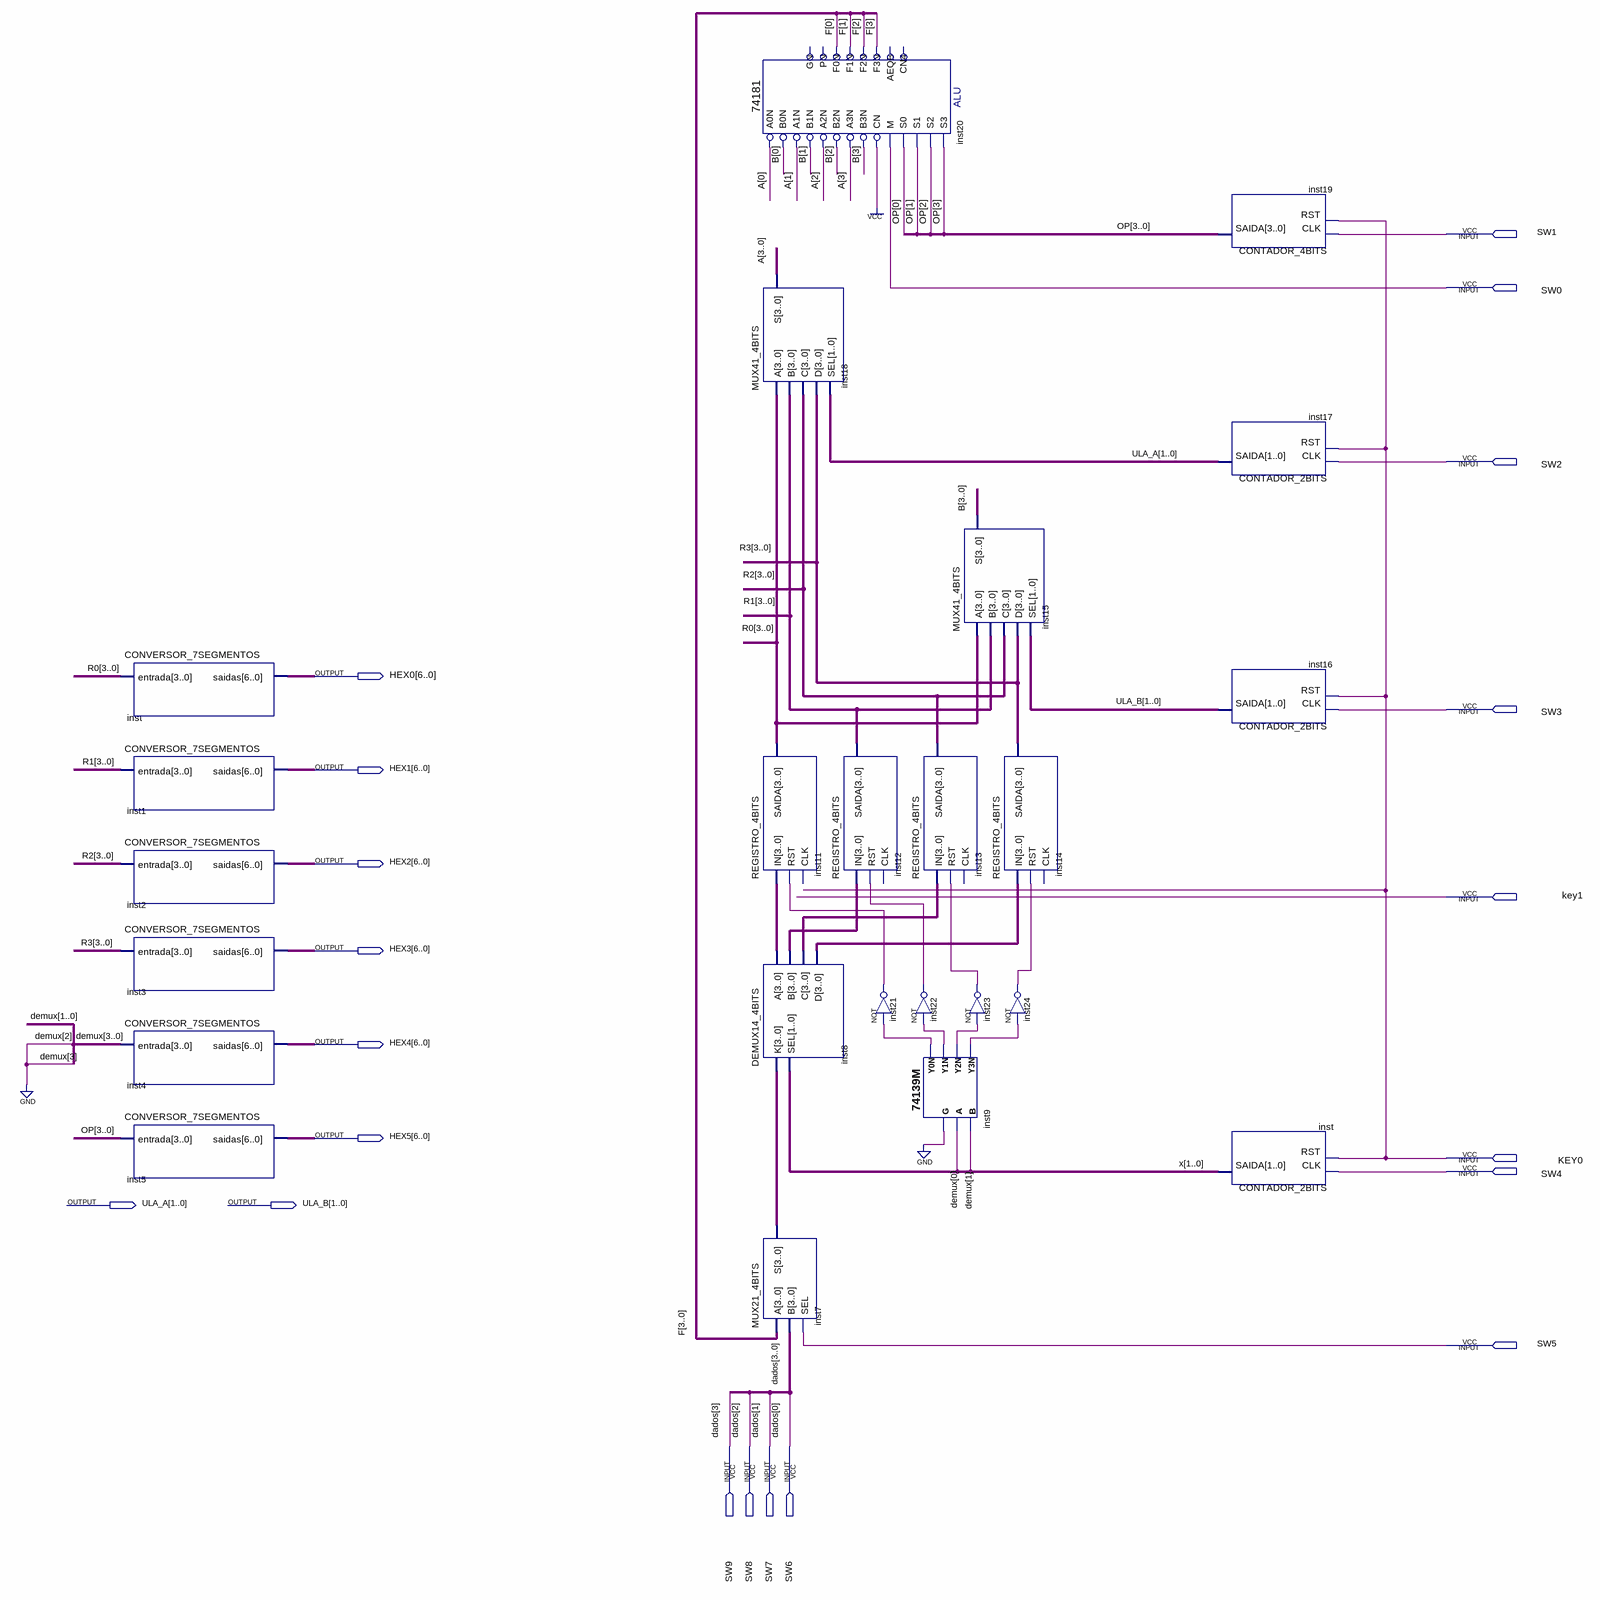
[diagram p0: schematic sheet]
// Quartus schematic LAB8.bdf as structural Verilog: 24 symbols, 20 pins
module LAB8 (
  input  SW1,
  input  SW0,
  input  SW2,
  input  SW3,
  input  key1,
  input  KEY0,
  input  SW4,
  input  SW5,
  input  SW9,
  input  SW8,
  input  SW7,
  input  SW6,
  output [6:0] HEX0,
  output [6:0] HEX1,
  output [6:0] HEX2,
  output [6:0] HEX3,
  output [6:0] HEX4,
  output [6:0] HEX5,
  output [1:0] ULA_A,
  output [1:0] ULA_B
);

  wire inst9_y0n, inst9_y1n, inst9_y2n, inst9_y3n, inst21_out, inst22_out, inst23_out, inst24_out;
  wire [1:0] demux, x;
  wire [3:0] A, B, F, inst7_s, inst8_a, inst8_b, inst8_c, inst8_d, OP, R0, R1, R2, R3;

  CONVERSOR_7SEGMENTOS inst (.entrada(R0), .saidas(HEX0));
  CONVERSOR_7SEGMENTOS inst1 (.entrada(R1), .saidas(HEX1));
  CONVERSOR_7SEGMENTOS inst2 (.entrada(R2), .saidas(HEX2));
  CONVERSOR_7SEGMENTOS inst3 (.entrada(R3), .saidas(HEX3));
  CONVERSOR_7SEGMENTOS inst4 (.entrada({2'b00, demux}), .saidas(HEX4));
  CONVERSOR_7SEGMENTOS inst5 (.entrada(OP), .saidas(HEX5));
  \74181  inst20 (
    .B0N(B[0]), .A0N(A[0]), .A1N(A[1]), .B1N(B[1]), .A3N(A[3]), .B2N(B[2]), .A2N(A[2]), .M(SW0), .CN(1'b1),
    .B3N(B[3]), .S2(OP[2]), .S1(OP[1]), .S0(OP[0]), .S3(OP[3]), .F3N(F[3]), .F1N(F[1]), .F0N(F[0]), .F2N(F[2]));  // open: PN, GN, AEQB, CN4
  MUX41_4BITS inst18 (.A(R0), .B(R1), .C(R2), .D(R3), .SEL(ULA_A), .S(A));
  REGISTRO_4BITS inst11 (.IN(inst8_a), .RST(inst21_out), .SAIDA(R0));  // open: CLK
  DEMUX14_4BITS inst8 (.K(inst7_s), .SEL(x), .A(inst8_a), .B(inst8_b), .C(inst8_c), .D(inst8_d));
  MUX21_4BITS inst7 (.A(F), .B({SW9, SW8, SW7, SW6}), .SEL(SW5), .S(inst7_s));
  REGISTRO_4BITS inst12 (.IN(inst8_b), .RST(inst22_out), .SAIDA(R1));  // open: CLK
  not inst21 (inst21_out, inst9_y0n);
  REGISTRO_4BITS inst13 (.IN(inst8_c), .RST(inst23_out), .SAIDA(R2));  // open: CLK
  not inst22 (inst22_out, inst9_y1n);
  \74139M  inst9 (
    .B(demux[1]), .A(demux[0]), .G(1'b0), .Y3N(inst9_y3n), .Y2N(inst9_y2n), .Y0N(inst9_y0n), .Y1N(inst9_y1n));
  MUX41_4BITS inst15 (.A(R0), .B(R1), .C(R2), .D(R3), .SEL(ULA_B), .S(B));
  not inst23 (inst23_out, inst9_y2n);
  REGISTRO_4BITS inst14 (.IN(inst8_d), .RST(inst24_out), .SAIDA(R3));  // open: CLK
  not inst24 (inst24_out, inst9_y3n);
  CONTADOR_4BITS inst19 (.CLK(SW1), .RST(KEY0), .SAIDA(OP));
  CONTADOR_2BITS inst17 (.CLK(SW2), .RST(KEY0), .SAIDA(ULA_A));
  CONTADOR_2BITS inst16 (.CLK(SW3), .RST(KEY0), .SAIDA(ULA_B));
  CONTADOR_2BITS inst_dup2 (.CLK(SW4), .RST(KEY0), .SAIDA(x));

  // Other names for the same wires on the sheet: dados[3:0] = {SW9, SW8, SW7, SW6}
endmodule
